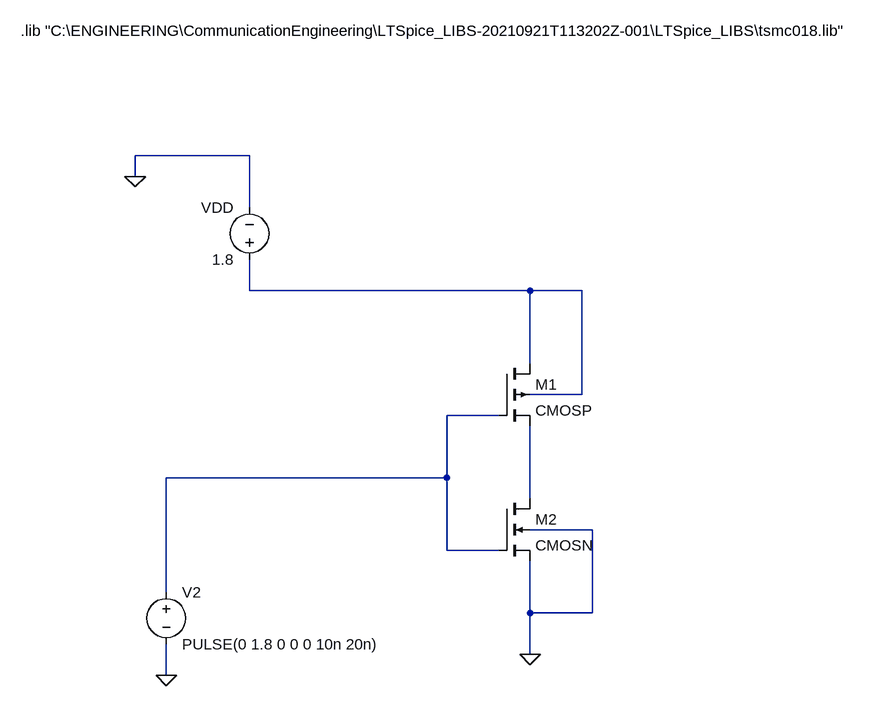
[diagram p0: schematic Draft3.asc]
Draft3.asc, the LTspice schematic file:
Version 4
SHEET 1 880 680
WIRE -208 -304 -384 -304
WIRE -384 -272 -384 -304
WIRE -208 -224 -208 -304
WIRE -208 -96 -208 -144
WIRE 224 -96 -208 -96
WIRE 304 -96 224 -96
WIRE 224 16 224 -96
WIRE 304 64 304 -96
WIRE 304 64 224 64
WIRE 176 96 96 96
WIRE 96 192 96 96
WIRE 96 192 -336 192
WIRE 224 224 224 112
WIRE 320 272 224 272
WIRE 96 304 96 192
WIRE 176 304 96 304
WIRE -336 368 -336 192
WIRE 224 400 224 320
WIRE 320 400 320 272
WIRE 320 400 224 400
WIRE 224 464 224 400
WIRE -336 496 -336 448
FLAG -384 -272 0
FLAG -336 496 0
FLAG 224 464 0
SYMBOL voltage -208 -128 R180
WINDOW 0 24 96 Left 2
WINDOW 3 24 16 Left 2
WINDOW 123 0 0 Left 0
WINDOW 39 0 0 Left 0
SYMATTR InstName VDD
SYMATTR Value 1.8
SYMBOL voltage -336 352 R0
WINDOW 123 0 0 Left 0
WINDOW 39 0 0 Left 0
SYMATTR InstName V2
SYMATTR Value PULSE(0 1.8 0 0 0 10n 20n)
SYMBOL pmos4 176 16 R0
SYMATTR InstName M1
SYMATTR Value CMOSP
SYMATTR Value2 l=180n w=660n
SYMBOL nmos4 176 224 R0
SYMATTR InstName M2
SYMATTR Value CMOSN
SYMATTR Value2 l=180n w=220n
TEXT -560 -496 Left 2 !.lib "C:\\ENGINEERING\\CommunicationEngineering\\LTSpice_LIBS-20210921T113202Z-001\\LTSpice_LIBS\\tsmc018.lib"

The netlist it stands for:
* Draft3.asc
VDD N001 0 1.8
V2 N002 0 PULSE(0 1.8 0 0 0 10n 20n)
M1 N001 N002 N003 N001 CMOSP l=180n w=660n
M2 N003 N002 0 0 CMOSN l=180n w=220n
.model NMOS NMOS
.model PMOS PMOS
.lib standard.mos
.lib "C:\ENGINEERING\CommunicationEngineering\LTSpice_LIBS-20210921T113202Z-001\LTSpice_LIBS\tsmc018.lib"
.backanno
.end